# EAGLE design MainBoard (EAGLE 7.3.0)
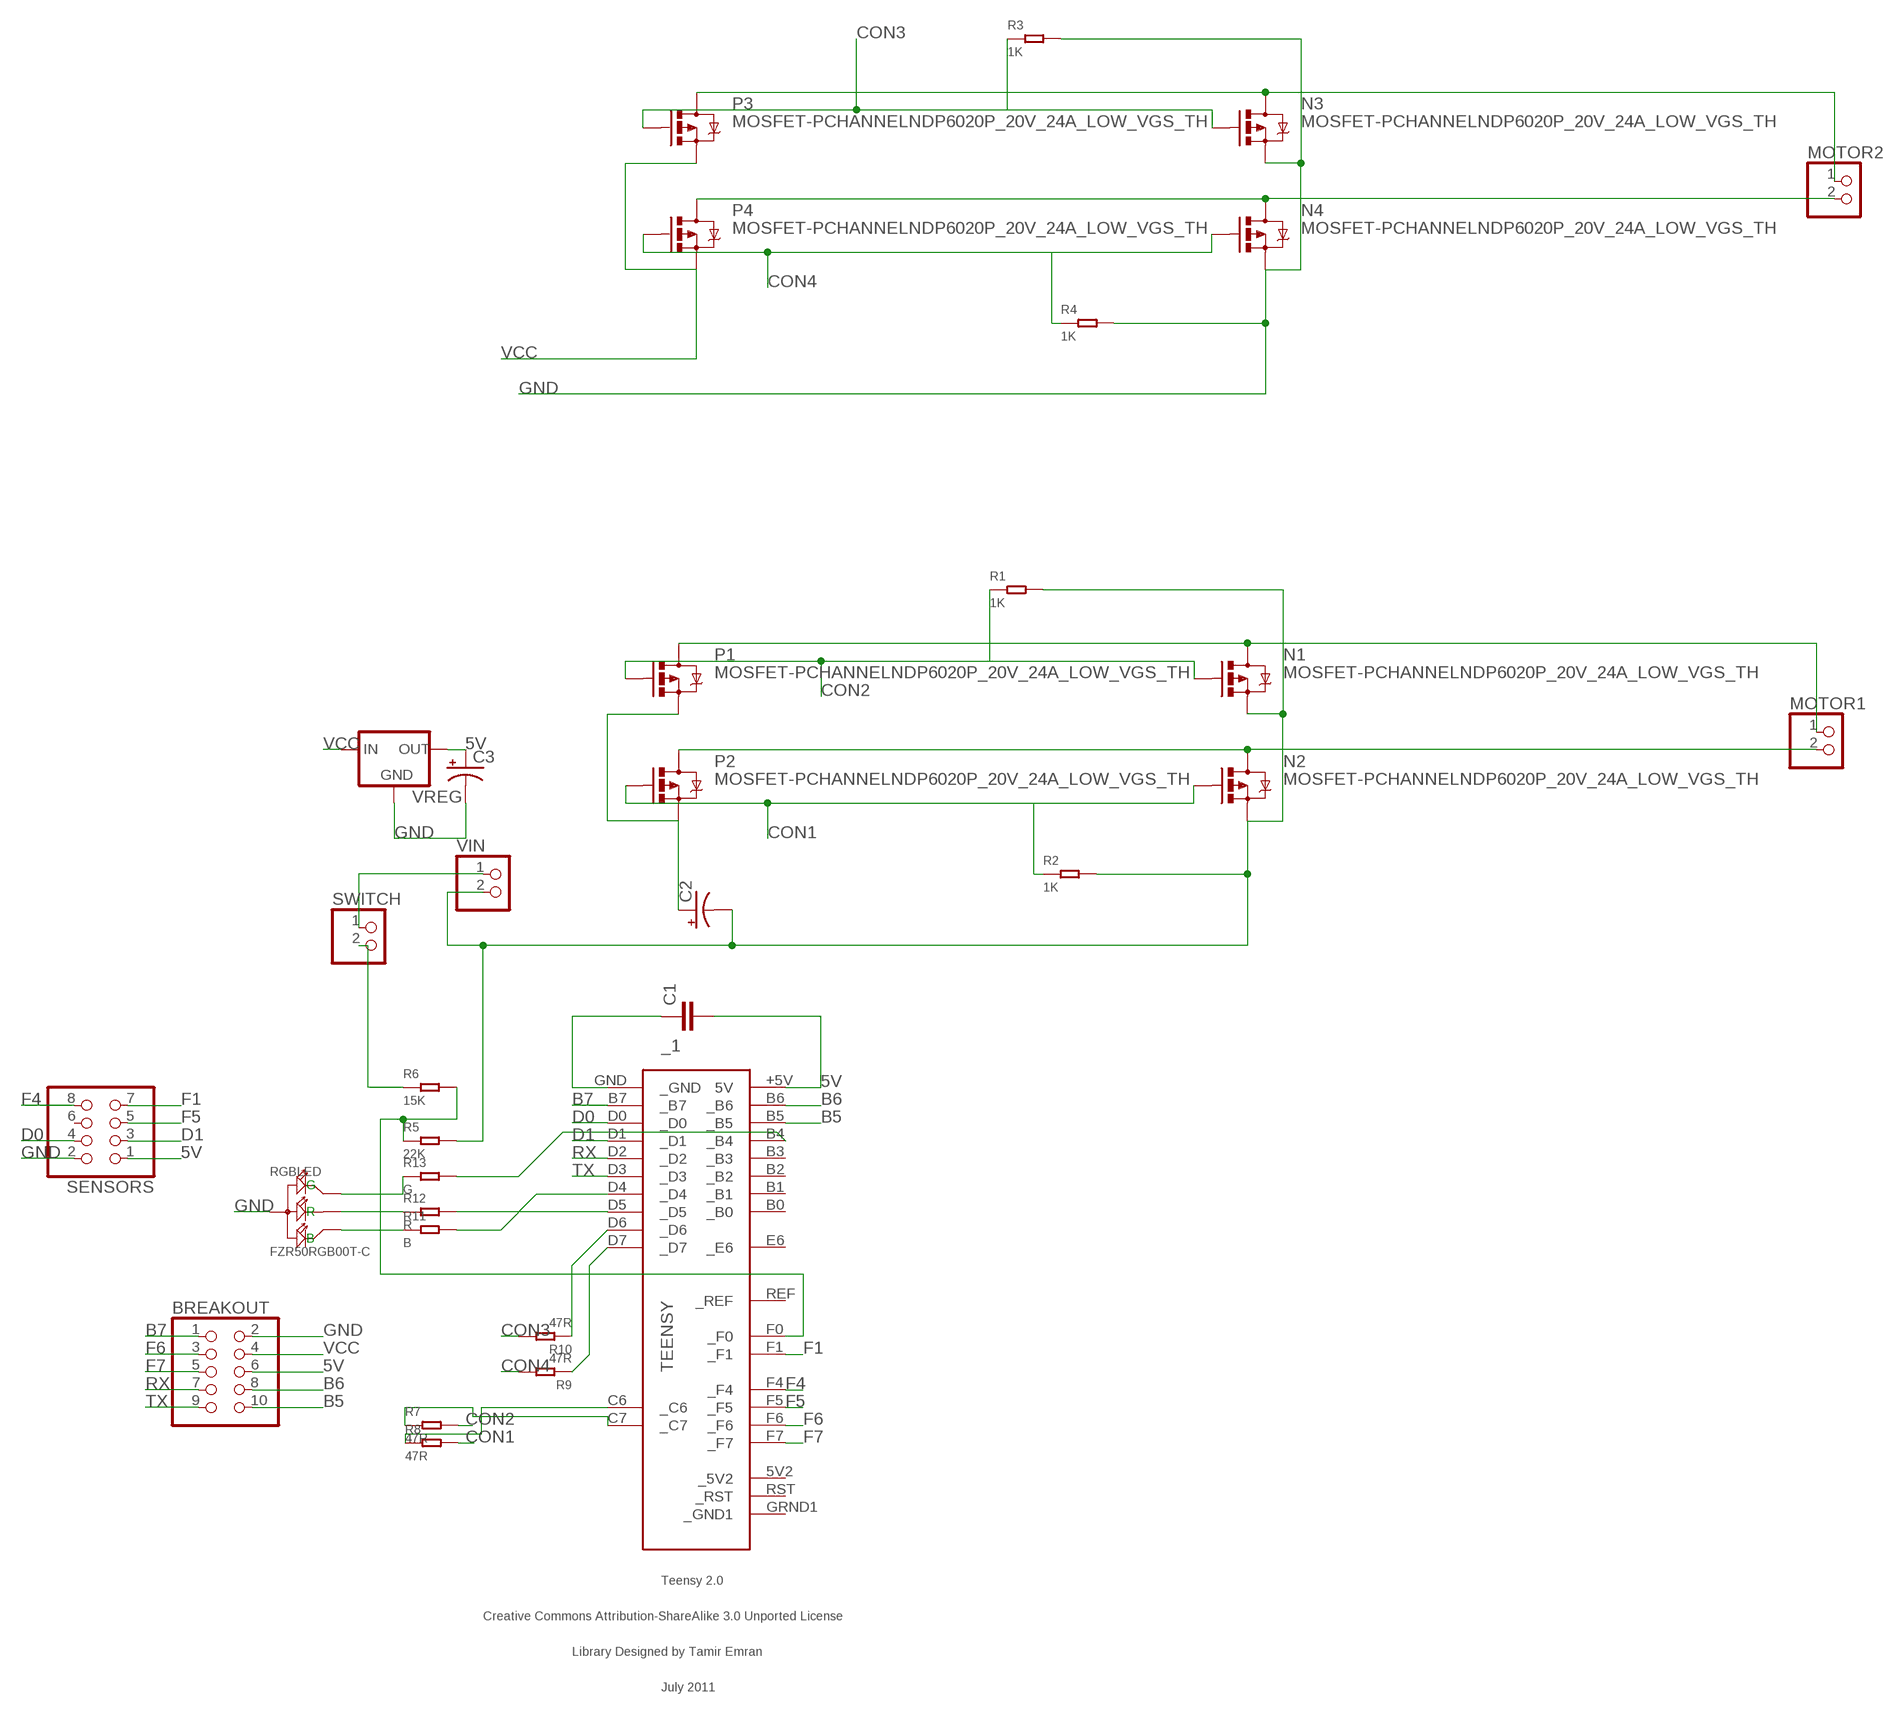
[diagram p0: schematic, sheet 1]

## Parts
_1  TEENSY  [TEENSY]
BREAKOUT  PINHD-2X5  [2X05]
C1  CAPPTH  [CAP-PTH-SMALL]
C2  CAP_POLPTH2  [CPOL-RADIAL-10UF-25V]
C3  CAP_POLPTH2  [CPOL-RADIAL-10UF-25V]
MOTOR1  PINHD-1X2  [1X02]
MOTOR2  PINHD-1X2  [1X02]
N1  MOSFET-PCHANNELNDP6020P_20V_24A_LOW_VGS_TH  [TO220V]
N2  MOSFET-PCHANNELNDP6020P_20V_24A_LOW_VGS_TH  [TO220V]
N3  MOSFET-PCHANNELNDP6020P_20V_24A_LOW_VGS_TH  [TO220V]
N4  MOSFET-PCHANNELNDP6020P_20V_24A_LOW_VGS_TH  [TO220V]
P1  MOSFET-PCHANNELNDP6020P_20V_24A_LOW_VGS_TH  [TO220V]
P2  MOSFET-PCHANNELNDP6020P_20V_24A_LOW_VGS_TH  [TO220V]
P3  MOSFET-PCHANNELNDP6020P_20V_24A_LOW_VGS_TH  [TO220V]
P4  MOSFET-PCHANNELNDP6020P_20V_24A_LOW_VGS_TH  [TO220V]
R1  1K  DIP-RES-1K-5%-1/4W(PR-D2.3XL6.5MM)  [PR-D2.3XL6.5MM]
R2  1K  DIP-RES-1K-5%-1/4W(PR-D2.3XL6.5MM)  [PR-D2.3XL6.5MM]
R3  1K  DIP-RES-1K-5%-1/4W(PR-D2.3XL6.5MM)  [PR-D2.3XL6.5MM]
R4  1K  DIP-RES-1K-5%-1/4W(PR-D2.3XL6.5MM)  [PR-D2.3XL6.5MM]
R5  22K  DIP-RES-22K-5%-1/4W(PR-D2.3XL6.5MM)  [PR-D2.3XL6.5MM]
R6  15K  DIP-RES-10K-5%-1/4W(PR-D2.3XL6.5MM)  [PR-D2.3XL6.5MM]
R7  47R  DIP-RES-47R-5%-1/4W(PR-D2.3XL6.5MM)  [PR-D2.3XL6.5MM]
R8  47R  DIP-RES-47R-5%-1/4W(PR-D2.3XL6.5MM)  [PR-D2.3XL6.5MM]
R9  47R  DIP-RES-47R-5%-1/4W(PR-D2.3XL6.5MM)  [PR-D2.3XL6.5MM]
R10  47R  DIP-RES-47R-5%-1/4W(PR-D2.3XL6.5MM)  [PR-D2.3XL6.5MM]
R11  B  DIP-RES-22K-5%-1/4W(PR-D2.3XL6.5MM)  [PR-D2.3XL6.5MM]
R12  R  DIP-RES-22K-5%-1/4W(PR-D2.3XL6.5MM)  [PR-D2.3XL6.5MM]
R13  G  DIP-RES-22K-5%-1/4W(PR-D2.3XL6.5MM)  [PR-D2.3XL6.5MM]
RGBLED  FZR50RGB00T-C  DIP-LED-RGB-COMMON-ANODE(4P-D5MM)  [LED4-1.3-D5.0MM]
SENSORS  PINHD-2X4  [2X04]
SWITCH  PINHD-1X2  [1X02]
VIN  PINHD-1X2  [1X02]
VREG  V_REG_78XXSINK  [TO220-IGO]

## Nets
5V: _1.+5V(5V) BREAKOUT.6 C1.2 C3.1(+) SENSORS.1 VREG.OUT
B5: _1.B5(_B5) BREAKOUT.10
B6: _1.B6(_B6) BREAKOUT.8
B7: _1.B7(_B7) BREAKOUT.1
CON1: N2.1(G) P2.1(G) R2.1 R8.2
CON2: N1.1(G) P1.1(G) R1.1 R7.2
CON3: N3.1(G) P3.1(G) R3.1 R10.2
CON4: N4.1(G) P4.1(G) R4.1 R9.2
D0: _1.D0(_D0) SENSORS.4
D1: _1.D1(_D1) SENSORS.3
F1: _1.F1(_F1) SENSORS.7
F4: _1.F4(_F4) SENSORS.8
F5: _1.F5(_F5) SENSORS.5
F6: _1.F6(_F6) BREAKOUT.3
F7: _1.F7(_F7) BREAKOUT.5
GND: _1.GND(_GND) BREAKOUT.2 C1.1 C2.2(-) C3.2(-) N1.3(S) N2.3(S) N3.3(S) N4.3(S) R1.2 R2.2 R3.2 R4.2 R5.2 RGBLED.C(+) SENSORS.2 VIN.2 VREG.GND
N$1: MOTOR1.1 N1.2(D) P1.2(D)
N$2: _1.D6(_D6) R10.1
N$3: MOTOR1.2 N2.2(D) P2.2(D)
N$4: MOTOR2.2 N4.2(D) P4.2(D)
N$5: _1.D7(_D7) R9.1
N$6: MOTOR2.1 N3.2(D) P3.2(D)
N$7: _1.C7(_C7) R7.1
N$8: _1.C6(_C6) R8.1
N$9: _1.F0(_F0) R5.1 R6.2
N$10: _1.D4(_D4) R11.2
N$11: SWITCH.1 VIN.1
N$12: _1.D5(_D5) R12.2
N$13: _1.B4(_B4) R13.2
N$14: R13.1 RGBLED.G
N$15: R12.1 RGBLED.R
N$16: R11.1 RGBLED.B
RX: _1.D2(_D2) BREAKOUT.7
TX: _1.D3(_D3) BREAKOUT.9
VCC: BREAKOUT.4 C2.1(+) P1.3(S) P2.3(S) P3.3(S) P4.3(S) R6.1 SWITCH.2 VREG.IN
Unconnected: _1.5V2(_5V2) _1.B0(_B0) _1.B1(_B1) _1.B2(_B2) _1.B3(_B3) _1.E6(_E6) _1.GRND1(_GND1) _1.REF(_REF) _1.RST(_RST) SENSORS.6

## Library data of the parts
_1 = teensy:TEENSY: Teensy 2.0 Original Design by Clint Fisher Modified Design by Tamir Emran Licensed Under Creative Commons Attribution-ShareAlike 3.0 Unported (CC BY-SA 3.0)
BREAKOUT = pinhead:PINHD-2X5: PIN HEADER
C1 = SparkFun-Passives:CAP: Capacitor Standard 0603 ceramic capacitor, and 0.1" leaded capacitor.
C2 C3 = SparkFun-Passives:CAP_POL: Capacitor Polarized These are standard SMD and PTH capacitors. Normally 10uF, 47uF, and 100uF in electrolytic and tantalum varieties. Always verify the external diameter of the through hole cap, it varies with capacity, voltage, and manufacturer. The EIA devices should be standard.
MOTOR1 MOTOR2 SWITCH VIN = pinhead:PINHD-1X2: PIN HEADER
N1-N4 P1-P4 = SparkFun-DiscreteSemi:MOSFET-PCHANNEL: Generic PMOSFET IRLML2244 - TRANS-11153 (SOT-23 -20V -4.3A) (1.Gate 2.Source 3.Drain) FQP27P06 - COM-10349 <http://www.sparkfun.com/products/10349> (TO-220 -60V -27A) (1.Gate 2.Source 3.Drain); PROD_ID: TRANS-13060
R1-R4 = Seeed-OPL-Resistor:DIP-RES-1K-5%-1/4W(PR-D2.3XL6.5MM): 301020000; MPN: FHCFR-1/4W-102J
R5 = Seeed-OPL-Resistor:DIP-RES-22K-5%-1/4W(PR-D2.3XL6.5MM): 301020018; MPN: FHCFR-1/4W-223J
R6 = Seeed-OPL-Resistor:DIP-RES-10K-5%-1/4W(PR-D2.3XL6.5MM): 301020001; VALUE: 10K
R7-R10 = Seeed-OPL-Resistor:DIP-RES-47R-5%-1/4W(PR-D2.3XL6.5MM): 301020014; MPN: FHCFR-1/4W-470J
R11-R13 = Seeed-OPL-Resistor:DIP-RES-22K-5%-1/4W(PR-D2.3XL6.5MM): 301020018; MPN: FHCFR-1/4W-223J; VALUE: 22K
RGBLED = Seeed-OPL-Diode:DIP-LED-RGB-COMMON-ANODE(4P-D5MM): 304090056; MPN: FZR50RGB00T-C
SENSORS = pinhead:PINHD-2X4: PIN HEADER
VREG = SparkFun-PowerIC:V_REG_78XX: Voltage Regulator Standard 78xx regulator. IGO (Input Ground Output). Spark Fun Electronics SKU : COM-00107

## Board
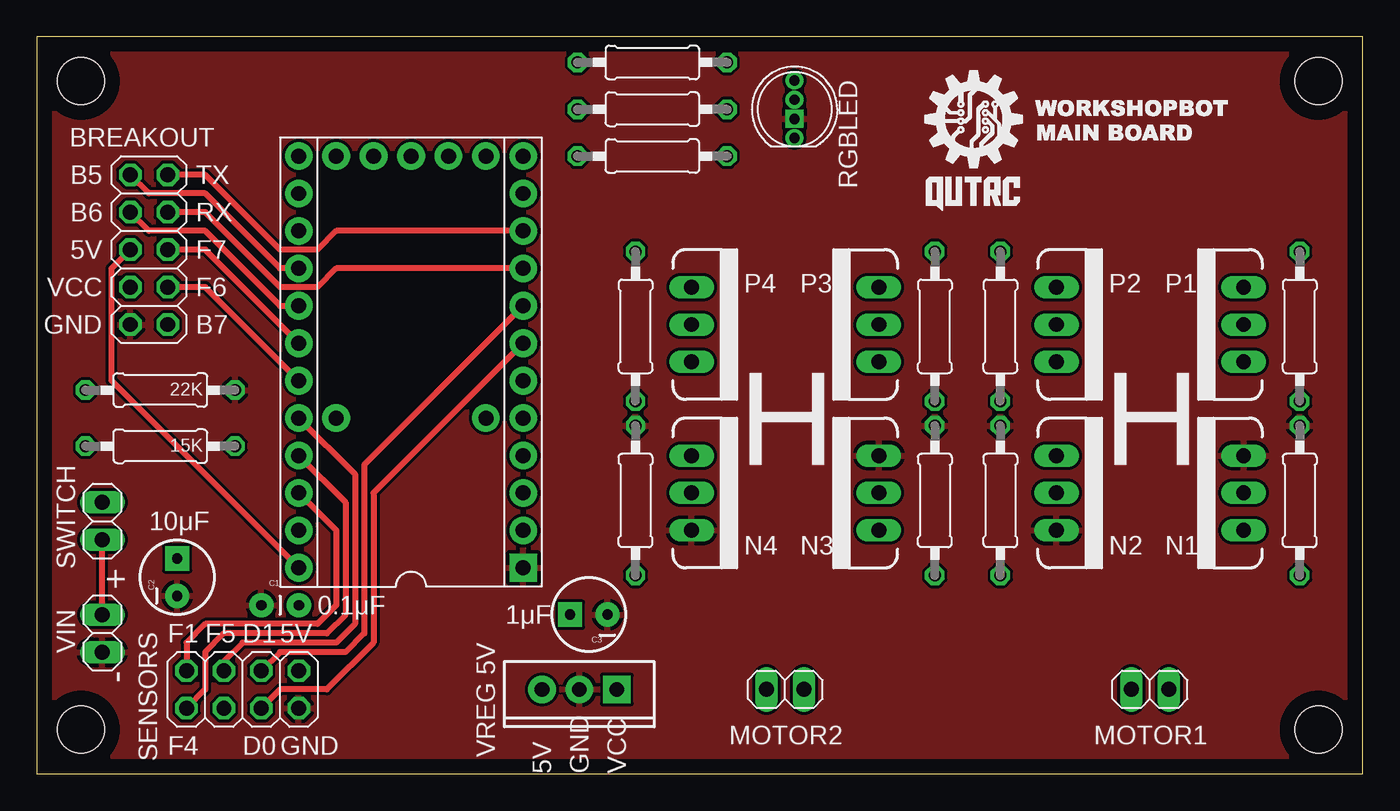
[diagram p1: board, top side]
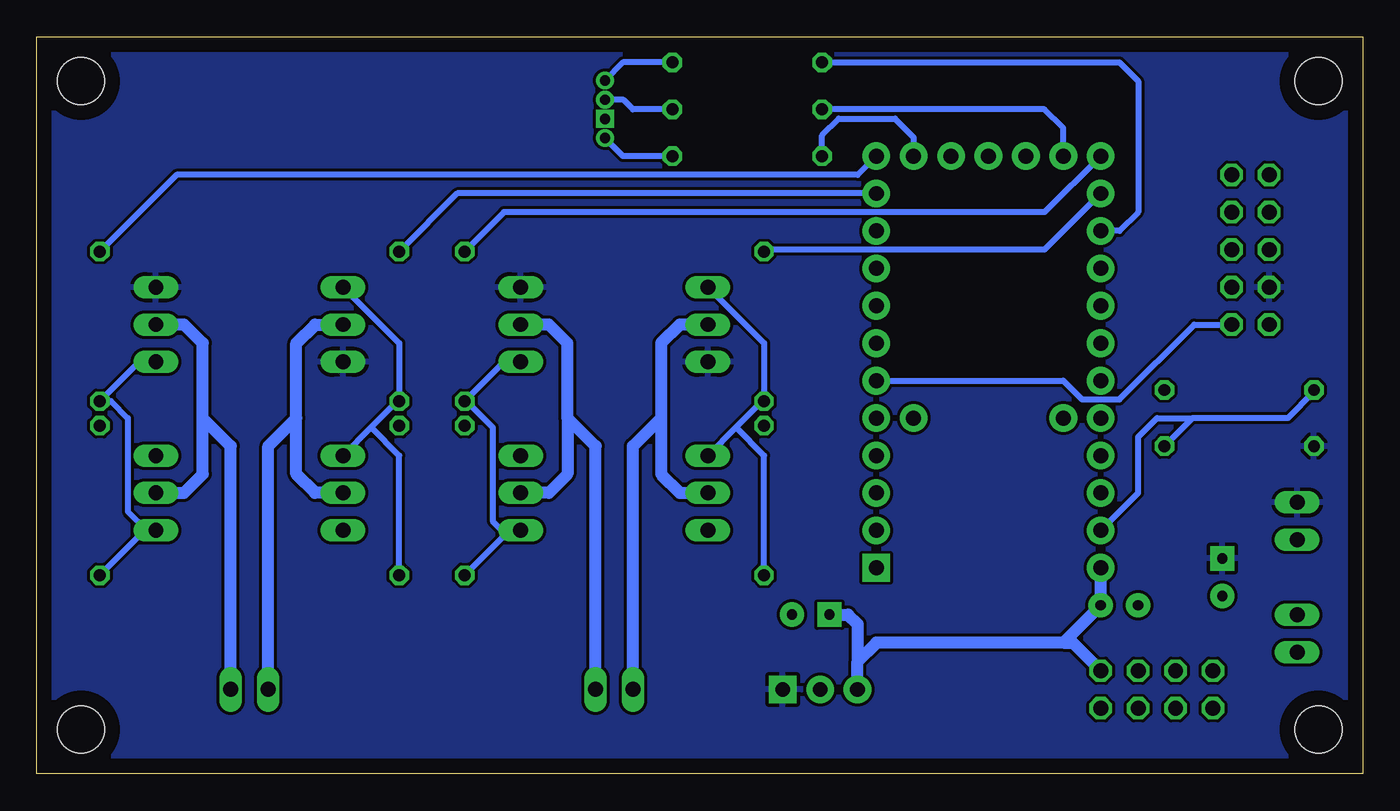
[diagram p2: board, bottom side, seen from below]

Size 90 x 50 mm. Coordinates in mm from the lower left corner, seen from the top.
Outline: 0,0 90,0 90,50 0,50 0,0
Copper layers (1*16): Top 0.035mm / dielectric 1.5mm / Bottom 0.035mm
Design rules "default": minimum track width 10mil, minimum drill 24mil, track to track 8mil, track to pad 8mil, pad to pad 8mil, via to via 8mil, smd to smd 8mil, copper to edge 40mil, drill to drill 8mil, minimum pad ring 10mil, minimum via ring 8mil, stop-mask expansion 4mil, vias tented up to drill 0mil, thermal gap 10mil
Holes 3.2 mm at 3,47 87,47 87,3 3,3

### Footprints (pad centres in the part's own frame; a part is rotated, then mirrored left to right if it is on the bottom)
TEENSY = drill 1.016 pad 1.88: 5V2 13.97,-2.54; +5V -13.97,7.62; B0 -11.43,-7.62; B1 -8.89,-7.62; B2 -6.35,-7.62; B3 -3.81,-7.62; B4 8.89,7.62; B5 6.35,7.62; B6 3.81,7.62; B7 -1.27,-7.62; C6 11.43,-7.62; C7 13.97,-7.62; D0 1.27,-7.62; D1 3.81,-7.62; D2 6.35,-7.62; D3 8.89,-7.62; D4 13.97,5.08; D5 13.97,-5.08; D6 13.97,7.62; D7 11.43,7.62; E6 -3.81,-5.08; F0 -11.43,7.62; F1 -8.89,7.62; F4 -6.35,7.62; F5 -3.81,7.62; F6 -1.27,7.62; F7 1.27,7.62; GRND1 13.97,0; REF -3.81,5.08; RST 13.97,2.54 | drill 1.016 pad 1.88 square: GND -13.97,-7.62
2X05 = drill 1.016 octagon: 1 -5.08,-1.27; 2 -5.08,1.27; 3 -2.54,-1.27; 4 -2.54,1.27; 5 0,-1.27; 6 0,1.27; 7 2.54,-1.27; 8 2.54,1.27; 9 5.08,-1.27; 10 5.08,1.27
CAP-PTH-SMALL = drill 0.7 pad 1.651: 1 0,0; 2 2.54,0
CPOL-RADIAL-10UF-25V = drill 0.7 pad 1.651 square: 1 1.27,0 | drill 0.7 pad 1.651: 2 -1.27,0
1X02 = drill 1.016 long: 1 -1.27,0; 2 1.27,0
TO220V = drill 1.016 long: 1 -2.54,0; 2 0,0; 3 2.54,0
PR-D2.3XL6.5MM = drill 0.813 octagon: 1 -4.953,0; 2 5.207,0
LED4-1.3-D5.0MM = drill 0.7 pad 1: B -0.65,0; G -1.95,0; R 1.95,0 | drill 0.7 pad 1 square: C 0.65,0
2X04 = drill 1.016 octagon: 1 -3.81,-1.27; 2 -3.81,1.27; 3 -1.27,-1.27; 4 -1.27,1.27; 5 1.27,-1.27; 6 1.27,1.27; 7 3.81,-1.27; 8 3.81,1.27
TO220-IGO = drill 1 pad 1.88: GND 0,0; OUT 2.54,0 | drill 1 pad 1.88 square: IN -2.54,0

### Placement (x,y rotation side)
_1  25.4,27.94 90 top
BREAKOUT  7.62,35.56 90 top
C1  15.24,11.43 0 top
C2  9.53,13.34 90 top
C3  37.47,10.79 180 top
MOTOR1  75.56,5.71 180 top
MOTOR2  50.8,5.71 180 top
N1  81.92,19.05 90 top
N2  69.22,19.05 270 top
N3  57.15,19.05 90 top
N4  44.45,19.05 270 top
P1  81.92,30.48 90 top
P2  69.22,30.48 270 top
P3  57.15,30.48 90 top
P4  44.45,30.48 270 top
R1  85.72,18.41 90 top
R2  65.41,18.41 90 top
R3  60.96,18.41 90 top
R4  40.64,18.41 90 top
R5  8.26,26.04 0 top
R6  8.26,22.23 0 top
R7  85.72,30.48 270 top
R8  65.41,30.48 270 top
R9  40.64,30.48 270 top
R10  60.96,30.48 270 top
R11  41.91,45.09 180 top
R12  41.91,41.91 180 top
R13  41.91,48.26 180 top
RGBLED  51.44,45.09 270 top
SENSORS  13.97,5.71 180 top
SWITCH  4.45,17.14 90 top
U$1  [LOGO1]  58.42,35.56 0 top
VIN  4.45,9.53 270 top
VREG  36.83,5.71 180 top

### Tracks (layer width: path | path; a pad name or v marks a point on that pad's centre or on a via)
5V
  Top 0.406: _1.+5V 5.08,26.67 5.08,34.29 BREAKOUT.6
  Bottom 0.813: VREG.OUT 34.29,7.62 | 34.29,7.62 33.02,8.89 20.32,8.89 | _1.+5V C1.2 20.32,8.89 | C3.1 34.92,10.79 34.29,10.16 34.29,7.62 | 20.32,8.89 19.68,8.89 SENSORS.1
B5
  Top 0.406: BREAKOUT.10 7.62,39.37 11.43,39.37 16.51,34.29 _1.B5
B6
  Top 0.406: BREAKOUT.8 7.62,36.83 11.43,36.83 16.51,31.75 _1.B6
B7
  Bottom 0.406: _1.B7 20.32,26.67 19.05,25.4 16.51,25.4 11.43,30.48 BREAKOUT.1
CON1
  Bottom 0.406: P2.1 65.41,29.21 R8.2 65.53,25.27 67.31,23.5 | 67.31,23.5 N2.1 | R2.1 65.41,21.59 67.31,23.5
CON2
  Bottom 0.406: P1.1 83.06,27.94 R7.2 84.96,25.27 83.82,24.13 83.82,17.78 82.55,16.51 | N1.1 82.55,16.51 | 82.55,16.51 82.68,16.51 R1.1
CON3
  Bottom 0.406: P3.1 58.29,27.94 R10.2 60.83,25.27 59.05,23.5 59.05,17.14 58.17,16.26 | N3.1 57.91,16.51 58.17,16.26 | 58.17,16.26 R3.1
CON4
  Bottom 0.406: P4.1 40.64,29.21 R9.2 40.77,25.27 42.55,23.5 | 42.55,23.5 N4.1 | R4.1 40.64,21.59 42.55,23.5
D0
  Top 0.406: _1.D0 22.86,19.05 22.86,8.89 19.68,5.71 16.51,5.71 SENSORS.4
D1
  Top 0.406: _1.D1 22.23,20.95 22.23,9.53 20.95,8.26 16.51,8.26 SENSORS.3
F1
  Top 0.406: _1.F1 20.32,16.51 20.32,11.43 19.05,10.16 11.43,10.16 10.16,8.89 SENSORS.7
F4
  Top 0.406: _1.F4 20.95,18.41 20.95,10.79 19.68,9.53 12.7,9.53 11.43,8.26 11.43,5.71 SENSORS.8
F5
  Top 0.406: _1.F5 21.59,20.32 21.59,10.16 20.32,8.89 13.97,8.89 12.7,7.62 SENSORS.5
F6
  Top 0.406: _1.F6 11.43,33.02 BREAKOUT.3
F7
  Top 0.406: _1.F7 11.43,35.56 BREAKOUT.5
GND
  pour Top: 0,0 0,50.16 90.17,50.16 90.17,0
N$1
  Bottom 0.813: N1.2 80.01,19.05 78.74,20.32 78.74,24.13 | 78.74,24.13 78.74,29.21 80.01,30.48 P1.2 | MOTOR1.1 76.83,22.23 78.74,24.13
N$2
  Bottom 0.406: _1.D6 21.59,38.1 58.29,38.1 R10.1
N$3
  Bottom 0.813: MOTOR1.2 74.3,22.23 72.39,24.13 | N2.2 71.12,19.05 72.39,20.32 72.39,24.13 | 72.39,24.13 72.39,29.21 71.12,30.48 P2.2
N$4
  Bottom 0.813: P4.2 46.35,30.48 47.62,29.21 47.62,24.13 | 47.62,24.13 47.62,20.32 46.35,19.05 N4.2 | MOTOR2.2 49.53,22.23 47.62,24.13
N$5
  Bottom 0.406: _1.D7 21.59,35.56 40.51,35.56 R9.1
N$6
  Bottom 0.813: MOTOR2.1 52.07,22.23 53.98,24.13 | 53.98,24.13 53.98,29.21 55.24,30.48 P3.2 | 53.98,24.13 53.98,20.32 55.24,19.05 N3.2
N$7
  Bottom 0.406: _1.C7 34.29,40.64 80.52,40.64 R7.1
N$8
  Bottom 0.406: _1.C6 61.47,39.37 R8.1
N$9
  Bottom 0.406: R5.1 3.3,25.91 5.08,24.13 11.43,24.13 11.56,24.13 | 11.56,24.13 R6.2 | _1.F0 15.24,19.05 15.24,22.86 13.97,24.13 11.56,24.13
N$10
  Bottom 0.406: _1.D4 20.32,43.81 21.59,45.09 R11.2
N$11
  Top 0.406: VIN.1 SWITCH.1
N$12
  Bottom 0.406: R12.2 36.7,43.31 35.56,44.45 31.75,44.45 30.48,43.18 _1.D5
N$13
  Bottom 0.406: R13.2 16.51,48.26 15.24,46.99 15.24,38.1 16.51,36.83 _1.B4
N$14
  Bottom 0.406: R13.1 50.21,48.26 RGBLED.G
N$15
  Bottom 0.406: R12.1 50.21,41.91 RGBLED.R
N$16
  Bottom 0.406: R11.1 49.53,45.09 50.16,45.72 51.42,45.72 RGBLED.B
RX
  Top 0.406: _1.D2 20.32,34.29 19.05,33.02 16.51,33.02 11.43,38.1 BREAKOUT.7
TX
  Top 0.406: _1.D3 20.32,36.83 19.05,35.56 16.51,35.56 11.43,40.64 BREAKOUT.9
VCC
  pour Bottom: 0,0 90.17,0 90.17,50.16 0,50.16

### Text on the board
tPlace: B5 | TX | B6 | RX | 5V | F7 | VCC | F6 | GND | B7 | H | H | 10μF | + | 0.1μF | 1μF | F1 | F5 | D1 | 5V | VREG 5V | - | F4 | D0 | GND | 5V | GND | VCC